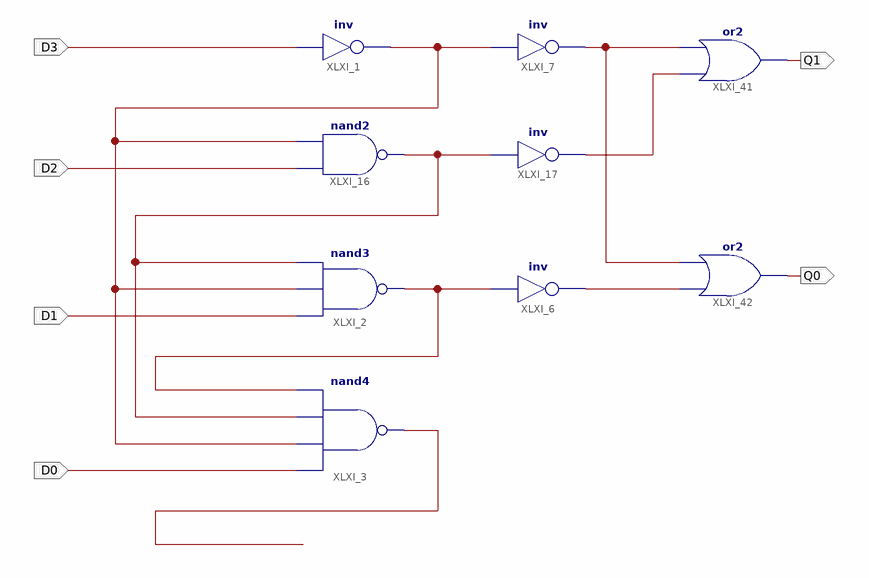
[diagram p0: schematic sheet 1]
// Xilinx ISE schematic e4_2.sch (spartan3e) as structural Verilog: 9 symbols, 6 ports
module e4_2 (
  input  D3,
  input  D2,
  input  D1,
  input  D0,
  output Q1,
  output Q0
);

  wire XLXN_50, XLXN_51, XLXN_52, XLXN_89, XLXN_98, XLXN_99, XLXN_100;

  not XLXI_1 (XLXN_50, D3);
  nand XLXI_2 (XLXN_52, D1, XLXN_50, XLXN_51);
  nand XLXI_3 (XLXN_89, D0, XLXN_50, XLXN_51, XLXN_52);
  nand XLXI_16 (XLXN_51, D2, XLXN_50);
  not XLXI_6 (XLXN_98, XLXN_52);
  not XLXI_7 (XLXN_100, XLXN_50);
  not XLXI_17 (XLXN_99, XLXN_51);
  or XLXI_41 (Q1, XLXN_99, XLXN_100);
  or XLXI_42 (Q0, XLXN_98, XLXN_100);
endmodule
